# Altium schematic sheet 1_P1.schdoc
size 309 x 223 mm; Symbol: Sheet-Symbol_A4; Device: Sheet-Symbol_A4; @Page Name: P1; @Create Date: 2022-11-23; @Page Count: 1; @Page No: 1; @Project Name: 平衡小车PCB; @Schematic Name: Schematic1; @Update Date: 2022-12-13; Company: 佳木斯大学; Drawed: 蒋欣桐; Page Size: A4; Reviewed: 蒋欣桐; Version: V1.0
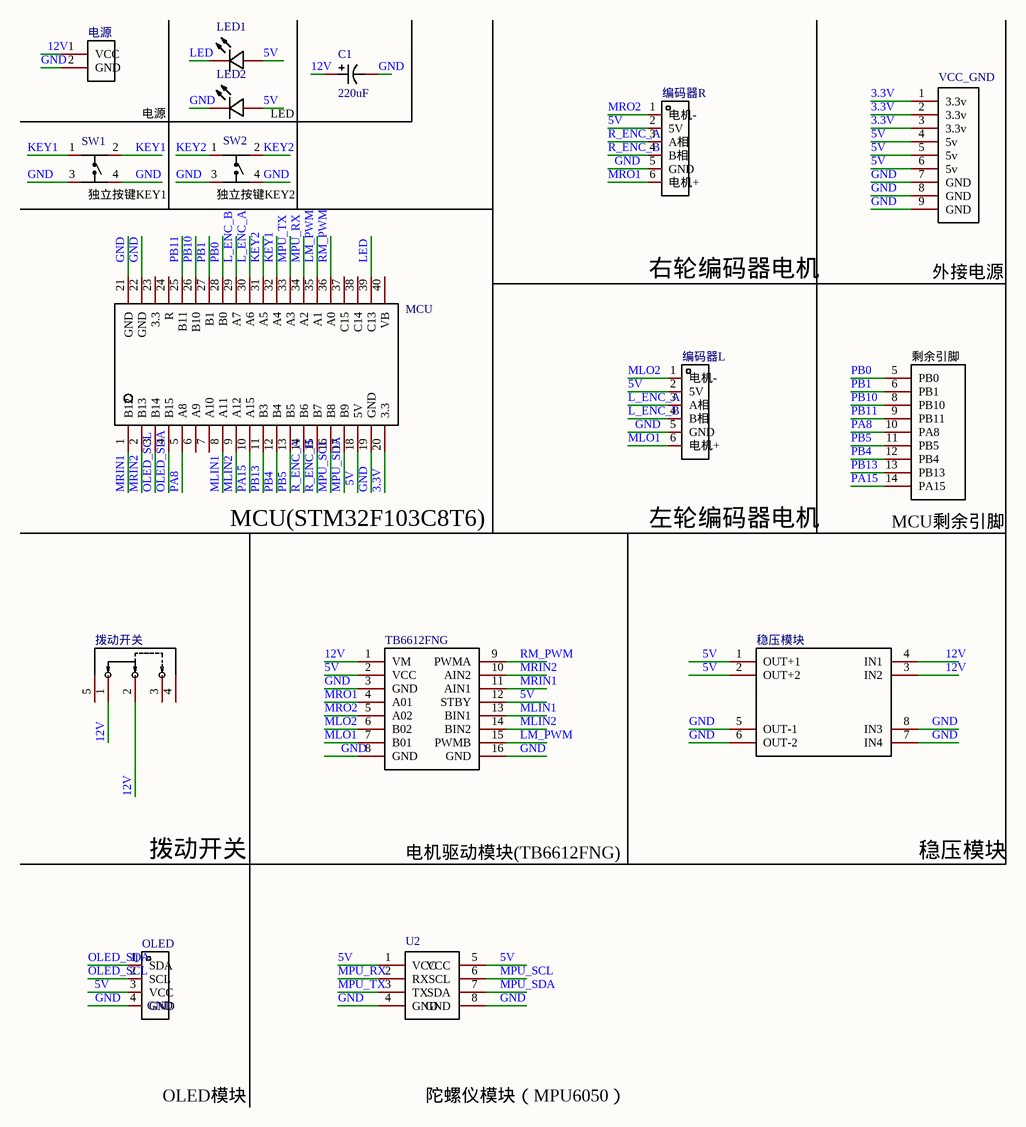
[diagram p0: 1_P1.schdoc]

## Parts
C1  value 220uF  [CAP-TH_BD8.0-P3.50-D0.6-FD_1]  (hidden comment: U1)
LED1  HL-PST-1608U51GC  [LED0603-R-RD_GREEN]  (value not drawn)
LED2  HL-PST-1608U51GC  [LED0603-R-RD_GREEN]  (value not drawn)
MCU  Stm32f103c8t6  [STM32F103]  (value not drawn)
OLED  NAME: GND  NUMBER: 1  [HDR-TH_4P-P2.54-V-F]  (hidden comment: OLED（4Pin）)
SW1  KH-6X6X5H-TJ  [SW-TH_4P-L6.0-W6.0-P4.50-LS6.5]  (value not drawn)
SW2  KH-6X6X5H-TJ  [SW-TH_4P-L6.0-W6.0-P4.50-LS6.5]  (value not drawn)
TB6612FNG  TB6612fng（16PIN）  [Tb6612FNg（8PIN）]  (value not drawn)
U1  MCU剩余引脚  [MCU多余引脚]  (value not drawn)
U2  MPU6050_JY-61  [MPU6050_JY-61]  (value not drawn)
VCC_GND  VCC_GND  [VCC_GND]  (value not drawn)
拨动开关  拨动开关（3PIN）  [SW-TH_SK12D07VG4]  (value not drawn)
电源  电源  [电源]  (value not drawn)
稳压模块  稳压模块（-5v）  [稳压模块（-5v）]  (value not drawn)
编码器L  A2547WR-6P  [CONN-TH-6P_A2547WR-6P]  (value not drawn)
编码器R  A2547WR-6P  [CONN-TH-6P_A2547WR-6P]  (value not drawn)

## Nets
3.3V: MCU.20(3.3) VCC_GND.1(3.3v) VCC_GND.2(3.3v) VCC_GND.3(3.3v)
5V: LED1.1(A) LED2.1(A) MCU.18(5V) OLED.3(VCC) TB6612FNG.2(VCC) TB6612FNG.12(STBY) U2.1(VCC) U2.5(VCC) VCC_GND.4(5v) VCC_GND.5(5v) VCC_GND.6(5v) 稳压模块.1(OUT+1) 稳压模块.2(OUT+2) 编码器L.2(5V) 编码器R.2(5V)
12V: C1.1 TB6612FNG.1(VM) 拨动开关.1 拨动开关.2 电源.1(VCC) 稳压模块.3(IN2) 稳压模块.4(IN1)
GND: C1.2 LED2.2(K) MCU.19(GND) MCU.21(GND) MCU.22(GND) OLED.4(GND) SW1.3 SW1.4 SW2.3 SW2.4 TB6612FNG.3(GND) TB6612FNG.8(GND) TB6612FNG.16(GND) U2.4(GND) U2.8(GND) VCC_GND.7(GND) VCC_GND.8(GND) VCC_GND.9(GND) 电源.2(GND) 稳压模块.5(OUT-1) 稳压模块.6(OUT-2) 稳压模块.7(IN4) 稳压模块.8(IN3) 编码器L.5(GND) 编码器R.5(GND)
KEY1: MCU.32(A4) SW1.1 SW1.2
KEY2: MCU.31(A5) SW2.1 SW2.2
L_ENC_A: MCU.30(A6) 编码器L.3(A相)
L_ENC_B: MCU.29(A7) 编码器L.4(B相)
LED: LED1.2(K) MCU.39(C13)
LM_PWM: MCU.35(A1) TB6612FNG.15(PWMB)
MLIN1: MCU.8(A11) TB6612FNG.13(BIN1)
MLIN2: MCU.9(A12) TB6612FNG.14(BIN2)
MLO1: TB6612FNG.7(B01) 编码器L.6(电机+)
MLO2: TB6612FNG.6(B02) 编码器L.1(电机-)
MPU_RX: MCU.34(A2) U2.2(RX)
MPU_SCL: MCU.16(B8) U2.6(SCL)
MPU_SDA: MCU.17(B9) U2.7(SDA)
MPU_TX: MCU.33(A3) U2.3(TX)
MRIN1: MCU.1(B12) TB6612FNG.11(AIN1)
MRIN2: MCU.2(B13) TB6612FNG.10(AIN2)
MRO1: TB6612FNG.4(A01) 编码器R.6(电机+)
MRO2: TB6612FNG.5(A02) 编码器R.1(电机-)
OLED_SCL: MCU.3(B14) OLED.2(SCL)
OLED_SDA: MCU.4(B15) OLED.1(SDA)
PA8: MCU.5(A8) U1.10(PA8)
PA15: MCU.10(A15) U1.14(PA15)
PB0: MCU.28(B0) U1.5(PB0)
PB1: MCU.27(B1) U1.6(PB1)
PB4: MCU.12(B4) U1.12(PB4)
PB5: MCU.13(B5) U1.11(PB5)
PB10: MCU.26(B10) U1.8(PB10)
PB11: MCU.25(B11) U1.9(PB11)
PB13: MCU.11(B3) U1.13(PB13)
R_ENC_A: MCU.14(B6) 编码器R.3(A相)
R_ENC_B: MCU.15(B7) 编码器R.4(B相)
RM_PWM: MCU.36(A0) TB6612FNG.9(PWMA)

Not connected (* = marked no-connect by the designer): MCU 6(A9) 7(A10) 23(3.3) 24(R) 37(C15) 38(C14) 40(VB); 拨动开关 3 4 5

## Notes on the sheet
- 电源
- LED
- (near SW1) 独立按键KEY1
- (near SW2) 独立按键KEY2
- 右轮编码器电机
- 外接电源
- MCU(STM32F103C8T6)
- 左轮编码器电机
- (near U1) MCU剩余引脚
- 拨动开关
- 电机驱动模块(TB6612FNG)
- 稳压模块
- OLED模块
- 陀螺仪模块（MPU6050）
- 1
- 2
- 3
- 4
- 5
- 6
- A
- B
- C
- Schematic
- @Schematic Name:Schematic1
- Create Date
- Update Date
- @Create Date:2022-11-23
- @Update Date:2022-12-13
- Reviewed
- Drawed
- Page
- Drawed:蒋欣桐
- Reviewed:蒋欣桐
- @Page Name:P1
- Part Number
- @Project Name:平衡小车PCB
- Part Number:
- D
- VER
- SIZE
- PAGE
- @Page No:1
- OF
- @Page Count:1
- Device
- Version:V1.0
- Page Size:A4
- Company:佳木斯大学
- Symbol
- (in symbol MCU剩余引脚) 剩余引脚

## Library data of the parts
C1 = U1: 容值:220uF;额定电压:25V;电容体直径:-;电容体长度:-;脚间距:3.5mm;纹波电流:-;等效串联电阻:-;工作寿命:-;; Manufacturer: PANASONIC(松下); Symbol: EEUFM1E221; Add into BOM: yes; Rated Voltage: 25V; Name: 220uF; Device: U1; Convert to PCB: yes; LCSC Part Name: 220uF 25V; Supplier Part: C278529; Manufacturer Part: EEUFM1E221; Supplier Footprint: 直插,D8xL11.5mm; JLCPCB Part Class: Extended Part; Datasheet: https://atta.szlcsc.com/upload/public/pdf/source/20200731/C278529_E62EBAE9E797D75A5E8FE5BEA49CFF8A.pdf; Supplier: LCSC; φD: -; L: -; Lead Spacing: 3.5mm; Ripple Current: -; Equivalent Series Resistance(ESR): -; Lifetime @ Temp: -
LED1 LED2 = HL-PST-1608U51GC: 发光颜色:翠绿;透镜颜色:无色透明;主波长:-;色温:-;测试电流:10mA;功率:66mW;发光角度:130°;安装方式:正贴;工作温度:-40~+85;; Manufacturer: HONGLITRONIC(鸿利光电); Add into BOM: yes; Emitted Color: 翠绿; Lens Color: 无色透明; Forward Current: 10mA; Power Dissipation: 66mW; Viewing Angle: 130°; Mounting Sytle: 正贴; Name: HL-PST-1608U51GC; Symbol: HL-PST-1608U51GC; Device: HL-PST-1608U51GC; LCSC Part Name: 翠绿 正贴 贴片通用款; Supplier Part: C497927; Manufacturer Part: HL-PST-1608U51GC; Supplier Footprint: 0603; JLCPCB Part Class: Extended Part; Datasheet: https://atta.szlcsc.com/upload/public/pdf/source/20200323/C497927_0D009C2E95F6CA152E531CDE1F942D21.pdf; Supplier: LCSC; Convert to PCB: yes; Dominant Wavelength: -; Color Temperature: -; Operating Temperature: -40~+85
MCU = Stm32f103c8t6: 模块; Add into BOM: yes; Symbol: Stm32f103c8t6; Device: Stm32f103c8t6; Convert to PCB: yes
OLED = OLED（4Pin）: Symbol: A2541HWV-4P_C5176037; Add into BOM: yes; Device: OLED（4Pin）; Convert to PCB: yes
SW1 SW2 = KH-6X6X5H-TJ: 触点电流:50mA;额定电压(DC):12V;绝缘电阻:100MΩ;电路结构:单刀单掷;安装方式:直插;按钮形状:圆形按钮;按钮/盖帽颜色:黑色;作用力:260gf@±30gf;工作温度:-25~+70;引脚样式:PC引脚;开关长度:6mm;开关宽度:6mm;开关高度:5mm;带支架:否;; Manufacturer: kinghelm(金航标); Add into BOM: yes; Contact Current: 50mA; Voltage Rating (DC): 12V; Insulation Resistance: 100MΩ; Circuit: 单刀单掷; Actuator Style: 圆形按钮; Actuator/Cap Color: 黑色; Pin Style: PC引脚; Switch Length: 6mm; Switch Height: 5mm; Strike Gundam: 否; Name: KH-6X6X5H-TJ; Symbol: KH-6X6X5H-TJ; Device: KH-6X6X5H-TJ; Convert to PCB: yes; LCSC Part Name: KH-6X6X5H-TJ; Supplier Part: C2837515; Manufacturer Part: KH-6X6X5H-TJ; Supplier Footprint: 插件; Datasheet: https://atta.szlcsc.com/upload/public/pdf/source/20210608/C2837515_3AC7364073E039B9154A985C7CEA77BC.pdf; Supplier: LCSC; Mounting Style: 直插; Operating Force: 260gf@±30gf; Operating Temperature: -25~+70; Switch Width: 6mm
TB6612FNG = TB6612fng（16PIN）: Symbol: MPU6050fng（8PIN）; Add into BOM: yes; Device: TB6612fng（16PIN）; Convert to PCB: yes
U1 = MCU剩余引脚: Convert to PCB: yes; Symbol: MCU多余引脚; Device: MCU剩余引脚; Add into BOM: yes
U2 = MPU6050_JY-61: Convert to PCB: yes; Symbol: MPU6050_JY-61; Device: MPU6050_JY-61; Add into BOM: yes
VCC_GND = VCC_GND: Convert to PCB: yes; Symbol: VCC_GND; Device: VCC_GND; Add into BOM: yes
拨动开关 = 拨动开关（3PIN）: 额定电流(DC):500mA;额定电压(DC):50V;额定电流(AC):-;额定电压(AC):-;电路结构:单刀双掷;安装方式:卧插;机械寿命:5000;滑钮形状:矩形柱状;引脚样式:PC引脚;工作温度:-;开关高度:8.8mm;; Manufacturer: SHOU HAN(首韩); Name: SK12D07VG4; Add into BOM: yes; Current Rating (DC): 500mA; Voltage Rating (DC): 50V; Circuit: 单刀双掷; Mechanical Life: 5000; Actuator Style: 矩形柱状; Pin Style: PC引脚; Switch Height: 8.8mm; Symbol: SK12D07VG4; Device: 拨动开关（3PIN）; Convert to PCB: yes; LCSC Part Name: 3脚2二档位SK12D07VG4滑动开关1P2T卧式拨动开关; Supplier Part: C393937; Manufacturer Part: SK12D07VG4; Supplier Footprint: 插件; JLCPCB Part Class: Extended Part; Datasheet: https://atta.szlcsc.com/upload/public/pdf/source/20190521/C393937_939FE26E571CC67D2D532E953108A1B0.pdf; Supplier: LCSC; Current Rating (AC): -; Voltage Rating (AC): -; Mounting Style: 卧插; Operating Temperature: -
电源 = 电源: Add into BOM: yes; Symbol: 电源; Device: 电源; Convert to PCB: yes
稳压模块 = 稳压模块（-5v）: 模块; Add into BOM: yes; Symbol: 稳压模块（-5v）; Device: 稳压模块（-5v）; Convert to PCB: yes
编码器L 编码器R = A2547WR-6P: 参考系列:-;间距:2.54mm;插针结构:1x6P;排数:1;每排PIN数:6;行距:-;安装方式:-;触头材质:黄铜;; Manufacturer: CJT(长江连接器); Add into BOM: yes; Pitch: 2.54mm; Pins Structure: 1x6P; Number of PINs Per Row: 6; Name: A2547WR-6P; Symbol: A2547WR-6P; Device: A2547WR-6P; LCSC Part Name: 6P,插座,脚距2.54mm; Supplier Part: C239388; Manufacturer Part: A2547WR-6P; Supplier Footprint: 插件,P=2.54mm; JLCPCB Part Class: 扩展库; Datasheet: https://atta.szlcsc.com/upload/public/pdf/watermark/20190926/C239388_674FA85B66215A3371F70C6F1C303B06.pdf; Supplier: LCSC; Convert to PCB: yes; Reference Series: -; Number of Rows: 1; Row Spacing: -; Mounting Style: -; Contact Material: 黄铜